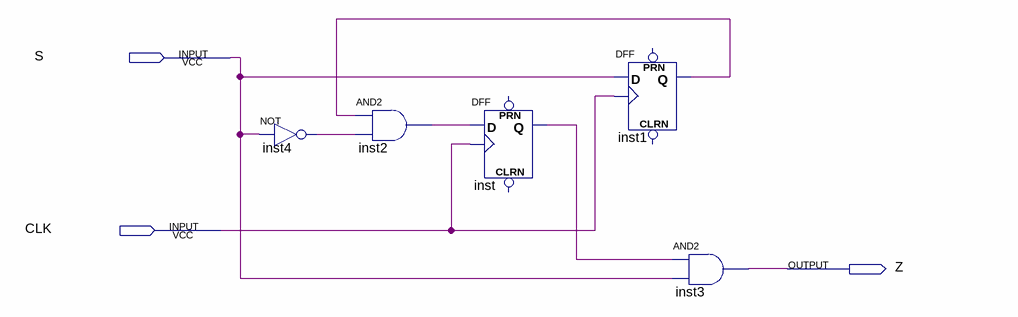
[diagram p0: schematic sheet]
// Quartus schematic Mealy-type.bdf as structural Verilog: 5 symbols, 3 pins
module \Mealy-type  (
  input  S,
  input  CLK,
  output Z
);

  wire inst1_q, inst2_out, inst4_out, inst_q;

  not inst4 (inst4_out, S);
  and inst2 (inst2_out, inst1_q, inst4_out);
  DFF inst (.CLK(CLK), .D(inst2_out), .Q(inst_q));  // open: CLRN, PRN
  DFF inst1 (.CLK(CLK), .D(S), .Q(inst1_q));  // open: CLRN, PRN
  and inst3 (Z, inst_q, S);
endmodule
